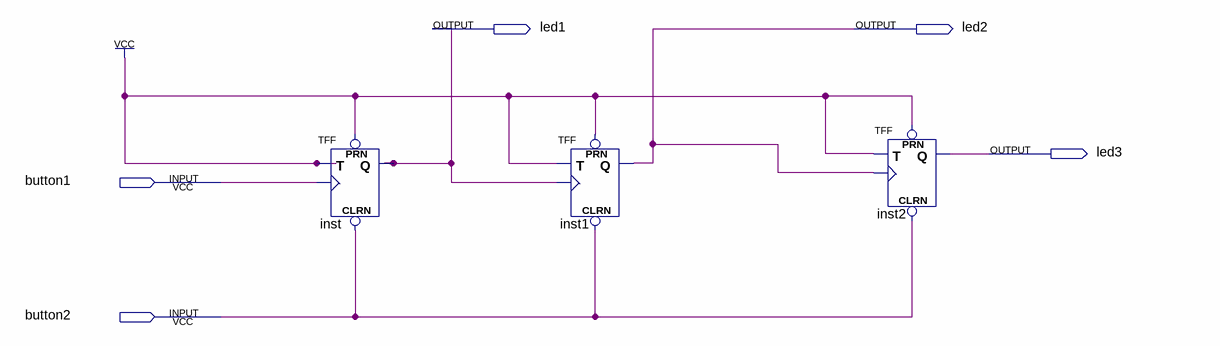
[diagram p0: schematic sheet]
// Quartus schematic counter_3bit.bdf as structural Verilog: 3 symbols, 5 pins
module counter_3bit (
  input  button1,
  input  button2,
  output led1,
  output led2,
  output led3
);

  TFF inst (.PRN(1'b1), .CLRN(button2), .T(1'b1), .CLK(button1), .Q(led1));
  TFF inst1 (.PRN(1'b1), .CLRN(button2), .T(1'b1), .CLK(led1), .Q(led2));
  TFF inst2 (.PRN(1'b1), .CLRN(button2), .T(1'b1), .CLK(led2), .Q(led3));
endmodule
